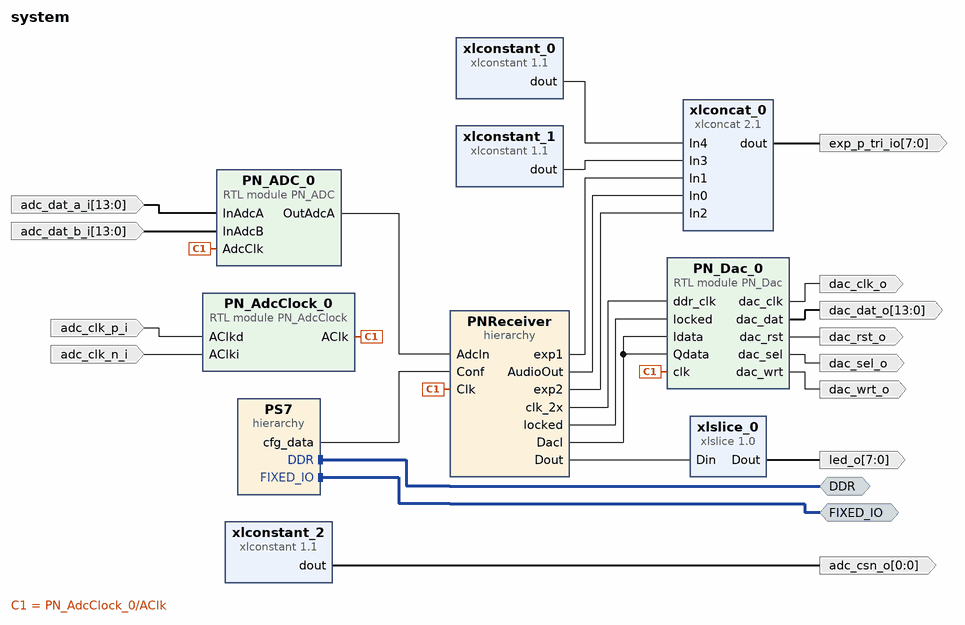
[diagram p0: block diagram of the top level]
# Vivado block design system, xc7z010clg400-2, Vivado 2017.2
create_bd_design system

create_bd_intf_port -mode Master -vlnv xilinx.com:interface:ddrx_rtl:1.0 DDR
create_bd_intf_port -mode Master -vlnv xilinx.com:display_processing_system7:fixedio_rtl:1.0 FIXED_IO
create_bd_port -dir O -from 7 -to 0 led_o
create_bd_port -dir O -from 7 -to 0 -type data exp_p_tri_io
create_bd_port -dir O -from 0 -to 0 adc_csn_o
create_bd_port -dir I adc_clk_p_i
create_bd_port -dir I adc_clk_n_i
create_bd_port -dir I -from 13 -to 0 adc_dat_a_i
create_bd_port -dir I -from 13 -to 0 adc_dat_b_i
create_bd_port -dir O dac_clk_o
create_bd_port -dir O dac_rst_o
create_bd_port -dir O dac_sel_o
create_bd_port -dir O dac_wrt_o
create_bd_port -dir O -from 13 -to 0 dac_dat_o

create_bd_cell -type hier PS7
create_bd_cell -type ip -vlnv xilinx.com:ip:xlslice:1.0 xlslice_0
set_property -dict {CONFIG.DIN_TO 0 CONFIG.DIN_FROM 7 CONFIG.DIN_WIDTH 16 CONFIG.DOUT_WIDTH 8} [get_bd_cells xlslice_0]
create_bd_cell -type ip -vlnv xilinx.com:ip:xlconcat:2.1 xlconcat_0
set_property -dict [list \
  CONFIG.NUM_PORTS 5 \
  CONFIG.IN0_WIDTH 1 \
  CONFIG.IN1_WIDTH 1 \
  CONFIG.IN2_WIDTH 1 \
  CONFIG.IN3_WIDTH 1 \
  CONFIG.IN4_WIDTH 4 \
] [get_bd_cells xlconcat_0]
create_bd_cell -type ip -vlnv xilinx.com:ip:xlconstant:1.1 xlconstant_0
set_property -dict {CONFIG.CONST_WIDTH 4 CONFIG.CONST_VAL 0} [get_bd_cells xlconstant_0]
create_bd_cell -type ip -vlnv xilinx.com:ip:xlconstant:1.1 xlconstant_1
set_property -dict {CONFIG.CONST_VAL 0} [get_bd_cells xlconstant_1]
create_bd_cell -type ip -vlnv xilinx.com:ip:xlconstant:1.1 xlconstant_2
create_bd_cell -type hier PNReceiver
create_bd_cell -type module -reference PN_AdcClock PN_AdcClock_0
create_bd_cell -type module -reference PN_ADC PN_ADC_0
create_bd_cell -type module -reference PN_Dac PN_Dac_0

# ---- hierarchy /PS7 ----
current_bd_instance /PS7
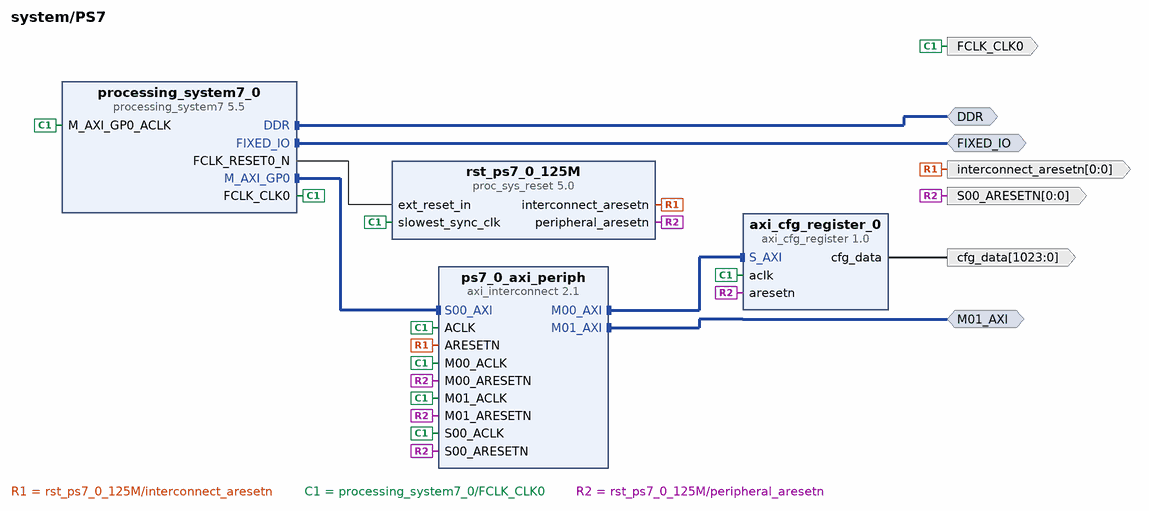
[diagram p1: block diagram inside /PS7]
create_bd_intf_pin -mode Master -vlnv xilinx.com:interface:ddrx_rtl:1.0 DDR
create_bd_intf_pin -mode Master -vlnv xilinx.com:display_processing_system7:fixedio_rtl:1.0 FIXED_IO
create_bd_intf_pin -mode Master -vlnv xilinx.com:interface:aximm_rtl:1.0 M01_AXI
create_bd_pin -dir O -type clk FCLK_CLK0
create_bd_pin -dir O -from 0 -to 0 -type rst S00_ARESETN
create_bd_pin -dir O -from 0 -to 0 -type rst interconnect_aresetn
create_bd_pin -dir O -from 1023 -to 0 cfg_data

create_bd_cell -type ip -vlnv xilinx.com:ip:processing_system7:5.5 processing_system7_0
set_property -dict [list \
  CONFIG.PCW_CPU_CPU_6X4X_MAX_RANGE 767 \
  CONFIG.PCW_QSPI_PERIPHERAL_FREQMHZ 125 \
  CONFIG.PCW_I2C_PERIPHERAL_FREQMHZ 111.111115 \
  CONFIG.PCW_FPGA0_PERIPHERAL_FREQMHZ 125 \
  CONFIG.PCW_FPGA1_PERIPHERAL_FREQMHZ 250 \
  CONFIG.PCW_FPGA3_PERIPHERAL_FREQMHZ 200 \
  CONFIG.PCW_IMPORT_BOARD_PRESET cfg/red_pitaya.xml \
  CONFIG.PCW_PRESET_BANK1_VOLTAGE {LVCMOS 2.5V} \
  CONFIG.PCW_UIPARAM_DDR_BUS_WIDTH {16 Bit} \
  CONFIG.PCW_UIPARAM_DDR_PARTNO {MT41J256M16 RE-125} \
  CONFIG.PCW_QSPI_PERIPHERAL_ENABLE 1 \
  CONFIG.PCW_QSPI_QSPI_IO {MIO 1 .. 6} \
  CONFIG.PCW_QSPI_GRP_SINGLE_SS_ENABLE 1 \
  CONFIG.PCW_QSPI_GRP_SINGLE_SS_IO {MIO 1 .. 6} \
  CONFIG.PCW_ENET0_PERIPHERAL_ENABLE 1 \
  CONFIG.PCW_ENET0_ENET0_IO {MIO 16 .. 27} \
  CONFIG.PCW_ENET0_GRP_MDIO_ENABLE 1 \
  CONFIG.PCW_ENET0_GRP_MDIO_IO EMIO \
  CONFIG.PCW_ENET_RESET_ENABLE 1 \
  CONFIG.PCW_ENET_RESET_SELECT {Share reset pin} \
  CONFIG.PCW_SD0_PERIPHERAL_ENABLE 1 \
  CONFIG.PCW_SD0_SD0_IO {MIO 40 .. 45} \
  CONFIG.PCW_SD0_GRP_CD_ENABLE 1 \
  CONFIG.PCW_SD0_GRP_CD_IO {MIO 46} \
  CONFIG.PCW_SD0_GRP_WP_ENABLE 1 \
  CONFIG.PCW_SD0_GRP_WP_IO {MIO 47} \
  CONFIG.PCW_UART0_PERIPHERAL_ENABLE 1 \
  CONFIG.PCW_UART0_UART0_IO {MIO 14 .. 15} \
  CONFIG.PCW_UART1_PERIPHERAL_ENABLE 1 \
  CONFIG.PCW_UART1_UART1_IO {MIO 8 .. 9} \
  CONFIG.PCW_SPI0_PERIPHERAL_ENABLE 1 \
  CONFIG.PCW_SPI0_SPI0_IO EMIO \
  CONFIG.PCW_SPI1_PERIPHERAL_ENABLE 1 \
  CONFIG.PCW_SPI1_SPI1_IO {MIO 10 .. 15} \
  CONFIG.PCW_TTC0_PERIPHERAL_ENABLE 1 \
  CONFIG.PCW_TTC0_TTC0_IO EMIO \
  CONFIG.PCW_USB0_PERIPHERAL_ENABLE 1 \
  CONFIG.PCW_USB0_USB0_IO {MIO 28 .. 39} \
  CONFIG.PCW_USB_RESET_ENABLE 1 \
  CONFIG.PCW_USB_RESET_SELECT {Share reset pin} \
  CONFIG.PCW_USB0_RESET_ENABLE 1 \
  CONFIG.PCW_USB0_RESET_IO {MIO 48} \
  CONFIG.PCW_I2C0_PERIPHERAL_ENABLE 1 \
  CONFIG.PCW_I2C0_I2C0_IO {MIO 50 .. 51} \
  CONFIG.PCW_I2C_RESET_ENABLE 1 \
  CONFIG.PCW_I2C_RESET_SELECT {Share reset pin} \
  CONFIG.PCW_GPIO_PERIPHERAL_ENABLE 1 \
  CONFIG.PCW_GPIO_MIO_GPIO_ENABLE 1 \
  CONFIG.PCW_GPIO_MIO_GPIO_IO MIO \
] [get_bd_cells processing_system7_0]
# 183 more settings of processing_system7_0 are not shown: defaults, MIO pin electricals, DDR timing, and values the tool derives
create_bd_cell -type ip -vlnv xilinx.com:ip:axi_interconnect:2.1 ps7_0_axi_periph
set_property -dict {CONFIG.NUM_SI 1 CONFIG.NUM_MI 2} [get_bd_cells ps7_0_axi_periph]
create_bd_cell -type ip -vlnv xilinx.com:ip:proc_sys_reset:5.0 rst_ps7_0_125M
create_bd_cell -type ip -vlnv pavel-demin:user:axi_cfg_register:1.0 axi_cfg_register_0

# ---- hierarchy /PNReceiver ----
current_bd_instance /PNReceiver
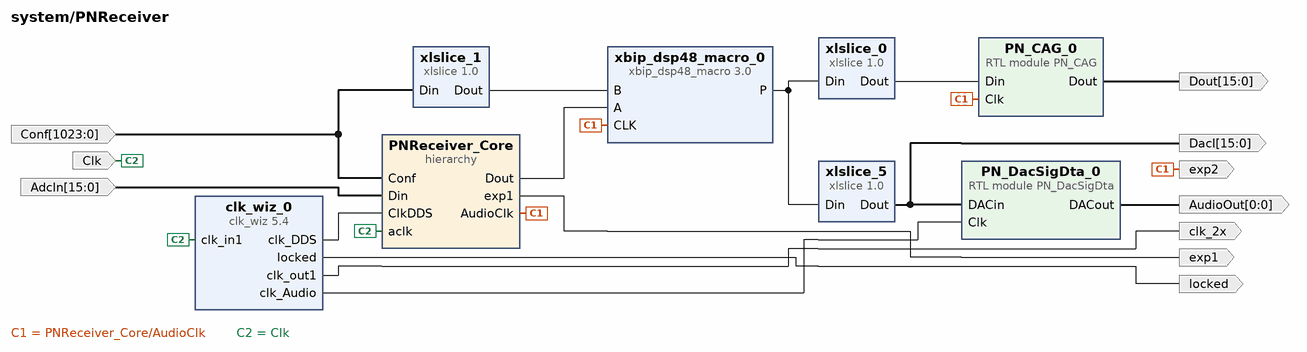
[diagram p2: block diagram inside /PNReceiver]
create_bd_pin -dir O -type clk clk_2x
create_bd_pin -dir O locked
create_bd_pin -dir I -from 1023 -to 0 Conf
create_bd_pin -dir I -type clk Clk
create_bd_pin -dir O -from 0 -to 0 AudioOut
create_bd_pin -dir O -from 15 -to 0 DacI
create_bd_pin -dir O exp2
create_bd_pin -dir O exp1
create_bd_pin -dir O -from 15 -to 0 Dout
create_bd_pin -dir I -from 15 -to 0 -type data AdcIn

create_bd_cell -type ip -vlnv xilinx.com:ip:clk_wiz:5.4 clk_wiz_0
set_property -dict [list \
  CONFIG.ENABLE_CLOCK_MONITOR false \
  CONFIG.PRIMITIVE MMCM \
  CONFIG.USE_PHASE_ALIGNMENT false \
  CONFIG.JITTER_SEL Min_O_Jitter \
  CONFIG.PRIM_IN_FREQ 125.000 \
  CONFIG.SECONDARY_SOURCE Single_ended_clock_capable_pin \
  CONFIG.CLKIN1_JITTER_PS 80.0 \
  CONFIG.CLKOUT2_USED true \
  CONFIG.CLKOUT3_USED true \
  CONFIG.CLKOUT4_USED false \
  CONFIG.NUM_OUT_CLKS 3 \
  CONFIG.CLK_OUT2_PORT clk_DDS \
  CONFIG.CLK_OUT3_PORT clk_Audio \
  CONFIG.CLK_OUT4_PORT clk_out4 \
  CONFIG.CLKOUT1_REQUESTED_OUT_FREQ 250.000 \
  CONFIG.CLKOUT2_REQUESTED_OUT_FREQ 500 \
  CONFIG.CLKOUT3_REQUESTED_OUT_FREQ 7.9 \
  CONFIG.CLKOUT4_REQUESTED_OUT_FREQ 100.000 \
  CONFIG.PRIM_SOURCE Single_ended_clock_capable_pin \
  CONFIG.CLKOUT1_DRIVES BUFG \
  CONFIG.CLKOUT2_DRIVES BUFG \
  CONFIG.CLKOUT3_DRIVES BUFG \
  CONFIG.CLKOUT4_DRIVES BUFG \
  CONFIG.CLKOUT5_DRIVES BUFG \
  CONFIG.CLKOUT6_DRIVES BUFG \
  CONFIG.CLKOUT7_DRIVES BUFG \
  CONFIG.USE_RESET false \
  CONFIG.MMCM_DIVCLK_DIVIDE 1 \
  CONFIG.MMCM_BANDWIDTH HIGH \
  CONFIG.MMCM_CLKFBOUT_MULT_F 8.000 \
  CONFIG.MMCM_CLKIN1_PERIOD 8.000 \
  CONFIG.MMCM_CLKIN2_PERIOD 10.000 \
  CONFIG.MMCM_CLKOUT0_DIVIDE_F 4.000 \
  CONFIG.MMCM_CLKOUT1_DIVIDE 2 \
  CONFIG.MMCM_CLKOUT2_DIVIDE 127 \
  CONFIG.MMCM_CLKOUT3_DIVIDE 1 \
  CONFIG.CLKOUT1_JITTER 104.759 \
  CONFIG.CLKOUT1_PHASE_ERROR 96.948 \
  CONFIG.CLKOUT2_JITTER 92.027 \
  CONFIG.CLKOUT2_PHASE_ERROR 96.948 \
  CONFIG.CLKOUT3_JITTER 207.034 \
  CONFIG.CLKOUT3_PHASE_ERROR 96.948 \
  CONFIG.CLKOUT4_JITTER 132.845 \
  CONFIG.CLKOUT4_PHASE_ERROR 306.660 \
] [get_bd_cells clk_wiz_0]
create_bd_cell -type ip -vlnv xilinx.com:ip:xlslice:1.0 xlslice_5
set_property -dict {CONFIG.DIN_TO 0 CONFIG.DIN_FROM 15 CONFIG.DIN_WIDTH 40 CONFIG.DOUT_WIDTH 16} [get_bd_cells xlslice_5]
create_bd_cell -type hier PNReceiver_Core
create_bd_cell -type ip -vlnv xilinx.com:ip:xlslice:1.0 xlslice_1
set_property -dict {CONFIG.DIN_TO 32 CONFIG.DIN_FROM 47 CONFIG.DIN_WIDTH 1024 CONFIG.DOUT_WIDTH 16} [get_bd_cells xlslice_1]
create_bd_cell -type ip -vlnv xilinx.com:ip:xbip_dsp48_macro:3.0 xbip_dsp48_macro_0
set_property -dict [list \
  CONFIG.instruction1 {A*B} \
  CONFIG.areg_3 true \
  CONFIG.areg_4 true \
  CONFIG.breg_3 true \
  CONFIG.breg_4 true \
  CONFIG.creg_3 false \
  CONFIG.creg_4 false \
  CONFIG.creg_5 false \
  CONFIG.mreg_5 true \
  CONFIG.preg_6 true \
  CONFIG.a_width 24 \
  CONFIG.a_binarywidth 0 \
  CONFIG.b_width 16 \
  CONFIG.b_binarywidth 0 \
  CONFIG.output_properties Full_Precision \
  CONFIG.p_full_width 40 \
  CONFIG.p_width 40 \
  CONFIG.p_binarywidth 0 \
  CONFIG.use_dsp48 true \
] [get_bd_cells xbip_dsp48_macro_0]
create_bd_cell -type ip -vlnv xilinx.com:ip:xlslice:1.0 xlslice_0
set_property -dict {CONFIG.DIN_TO 0 CONFIG.DIN_FROM 23 CONFIG.DIN_WIDTH 40 CONFIG.DOUT_WIDTH 24} [get_bd_cells xlslice_0]
create_bd_cell -type module -reference PN_CAG PN_CAG_0
create_bd_cell -type module -reference PN_DacSigDta PN_DacSigDta_0

# ---- hierarchy /PNReceiver/PNReceiver_Core ----
current_bd_instance /PNReceiver/PNReceiver_Core
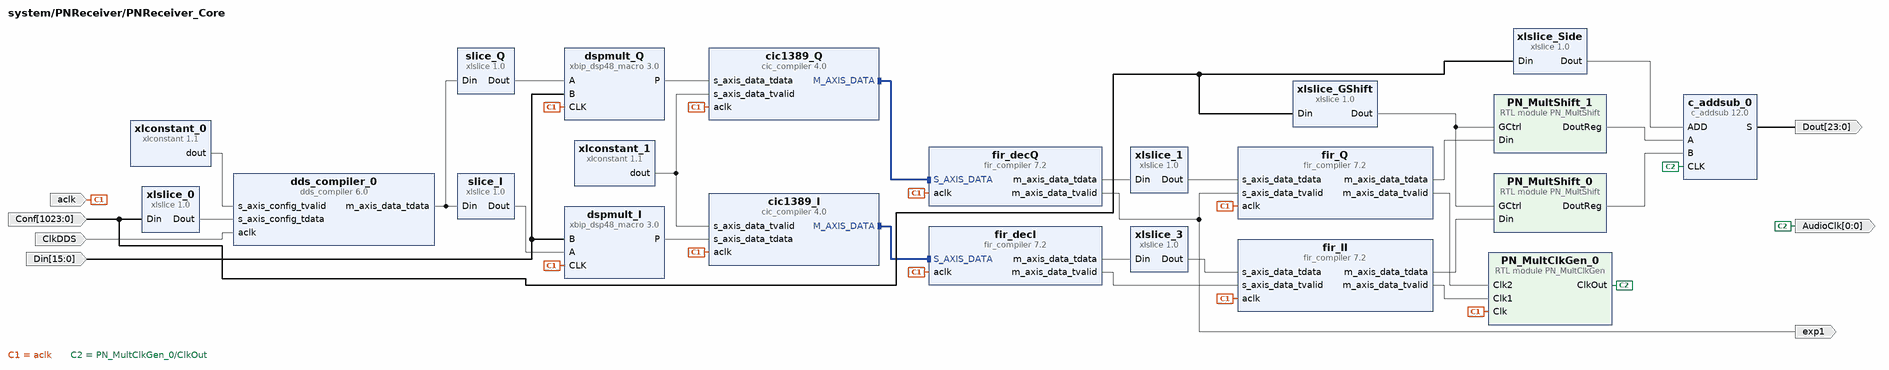
[diagram p3: block diagram inside /PNReceiver/PNReceiver_Core]
create_bd_pin -dir O -from 23 -to 0 -type data Dout
create_bd_pin -dir I -type clk ClkDDS
create_bd_pin -dir I -from 1023 -to 0 Conf
create_bd_pin -dir I -from 15 -to 0 -type data Din
create_bd_pin -dir O exp1
create_bd_pin -dir O -from 0 -to 0 AudioClk
create_bd_pin -dir I -type clk aclk

create_bd_cell -type ip -vlnv xilinx.com:ip:xlconstant:1.1 xlconstant_0
create_bd_cell -type ip -vlnv xilinx.com:ip:xlslice:1.0 slice_I
set_property -dict {CONFIG.DIN_FROM 15 CONFIG.DOUT_WIDTH 16} [get_bd_cells slice_I]
create_bd_cell -type ip -vlnv xilinx.com:ip:cic_compiler:4.0 cic1389_I
set_property -dict [list \
  CONFIG.Filter_Type Decimation \
  CONFIG.Number_Of_Stages 6 \
  CONFIG.Fixed_Or_Initial_Rate 1389 \
  CONFIG.Minimum_Rate 1389 \
  CONFIG.Maximum_Rate 1389 \
  CONFIG.RateSpecification Frequency_Specification \
  CONFIG.Input_Sample_Frequency 125 \
  CONFIG.Clock_Frequency 125 \
  CONFIG.SamplePeriod 1 \
  CONFIG.Response_Magnitude Full_Precision \
  CONFIG.Passband_Max 0.005 \
  CONFIG.Input_Data_Width 32 \
  CONFIG.Quantization Truncation \
  CONFIG.Output_Data_Width 32 \
  CONFIG.Use_Xtreme_DSP_Slice false \
] [get_bd_cells cic1389_I]
create_bd_cell -type ip -vlnv xilinx.com:ip:c_addsub:12.0 c_addsub_0
set_property -dict [list \
  CONFIG.Implementation Fabric \
  CONFIG.A_Type Signed \
  CONFIG.B_Type Signed \
  CONFIG.A_Width 24 \
  CONFIG.B_Width 24 \
  CONFIG.Add_Mode Add_Subtract \
  CONFIG.Out_Width 24 \
  CONFIG.Latency_Configuration Automatic \
  CONFIG.Latency 2 \
  CONFIG.B_Constant false \
  CONFIG.B_Value 000000000000000000000000 \
  CONFIG.CE false \
] [get_bd_cells c_addsub_0]
create_bd_cell -type ip -vlnv xilinx.com:ip:dds_compiler:6.0 dds_compiler_0
set_property -dict [list \
  CONFIG.DDS_Clock_Rate 500 \
  CONFIG.Parameter_Entry Hardware_Parameters \
  CONFIG.Frequency_Resolution 0.4 \
  CONFIG.Noise_Shaping None \
  CONFIG.Phase_Width 32 \
  CONFIG.Output_Width 16 \
  CONFIG.Phase_Increment Programmable \
  CONFIG.Output_Selection Sine_and_Cosine \
  CONFIG.Optimization_Goal Speed \
  CONFIG.Has_Phase_Out false \
  CONFIG.DATA_Has_TLAST Not_Required \
  CONFIG.S_PHASE_Has_TUSER Not_Required \
  CONFIG.M_DATA_Has_TUSER Not_Required \
  CONFIG.Latency 9 \
  CONFIG.Output_Frequency1 0 \
  CONFIG.PINC1 10100111110001011 \
] [get_bd_cells dds_compiler_0]
create_bd_cell -type ip -vlnv xilinx.com:ip:xbip_dsp48_macro:3.0 dspmult_I
set_property -dict [list \
  CONFIG.instruction1 {A*B} \
  CONFIG.pipeline_options Automatic \
  CONFIG.areg_3 true \
  CONFIG.areg_4 true \
  CONFIG.breg_3 true \
  CONFIG.breg_4 true \
  CONFIG.creg_1 false \
  CONFIG.creg_3 false \
  CONFIG.creg_4 false \
  CONFIG.creg_5 false \
  CONFIG.cinreg_3 false \
  CONFIG.cinreg_4 false \
  CONFIG.cinreg_5 false \
  CONFIG.mreg_5 true \
  CONFIG.preg_6 true \
  CONFIG.d_width 18 \
  CONFIG.a_width 16 \
  CONFIG.a_binarywidth 0 \
  CONFIG.b_width 16 \
  CONFIG.b_binarywidth 0 \
  CONFIG.concat_width 48 \
  CONFIG.concat_binarywidth 0 \
  CONFIG.c_width 48 \
  CONFIG.c_binarywidth 0 \
  CONFIG.pcin_binarywidth 0 \
  CONFIG.output_properties Full_Precision \
  CONFIG.p_full_width 32 \
  CONFIG.p_width 32 \
  CONFIG.p_binarywidth 0 \
  CONFIG.use_dsp48 true \
] [get_bd_cells dspmult_I]
create_bd_cell -type ip -vlnv xilinx.com:ip:fir_compiler:7.2 fir_decQ
set_property -dict [list \
  CONFIG.CoefficientSource COE_File \
  CONFIG.Coefficient_File ../../../../../../Filtre/Coeffd.coe \
  CONFIG.Coefficient_Sets 1 \
  CONFIG.Filter_Type Decimation \
  CONFIG.Interpolation_Rate 1 \
  CONFIG.Decimation_Rate 11 \
  CONFIG.Zero_Pack_Factor 1 \
  CONFIG.Number_Channels 1 \
  CONFIG.RateSpecification Frequency_Specification \
  CONFIG.Sample_Frequency 0.09 \
  CONFIG.Clock_Frequency 125 \
  CONFIG.Coefficient_Sign Signed \
  CONFIG.Quantization Quantize_Only \
  CONFIG.Coefficient_Width 24 \
  CONFIG.BestPrecision true \
  CONFIG.Coefficient_Fractional_Bits 18 \
  CONFIG.Coefficient_Structure Symmetric \
  CONFIG.Data_Width 32 \
  CONFIG.Output_Rounding_Mode Truncate_LSBs \
  CONFIG.Output_Width 37 \
  CONFIG.Filter_Architecture Systolic_Multiply_Accumulate \
  CONFIG.Optimization_Goal Area \
  CONFIG.Optimization_Selection None \
  CONFIG.Optimization_List None \
  CONFIG.S_DATA_Has_FIFO false \
] [get_bd_cells fir_decQ]
create_bd_cell -type ip -vlnv xilinx.com:ip:xlslice:1.0 slice_Q
set_property -dict {CONFIG.DIN_TO 16 CONFIG.DIN_FROM 31 CONFIG.DOUT_WIDTH 16} [get_bd_cells slice_Q]
create_bd_cell -type ip -vlnv xilinx.com:ip:cic_compiler:4.0 cic1389_Q
set_property -dict [list \
  CONFIG.Filter_Type Decimation \
  CONFIG.Number_Of_Stages 6 \
  CONFIG.Fixed_Or_Initial_Rate 1389 \
  CONFIG.Minimum_Rate 1389 \
  CONFIG.Maximum_Rate 1389 \
  CONFIG.RateSpecification Frequency_Specification \
  CONFIG.Input_Sample_Frequency 125 \
  CONFIG.Clock_Frequency 125 \
  CONFIG.SamplePeriod 1 \
  CONFIG.Response_Magnitude Full_Precision \
  CONFIG.Passband_Max 0.005 \
  CONFIG.Input_Data_Width 32 \
  CONFIG.Quantization Truncation \
  CONFIG.Output_Data_Width 32 \
  CONFIG.Use_Xtreme_DSP_Slice false \
] [get_bd_cells cic1389_Q]
create_bd_cell -type ip -vlnv xilinx.com:ip:fir_compiler:7.2 fir_decI
set_property -dict [list \
  CONFIG.CoefficientSource COE_File \
  CONFIG.Coefficient_File ../../../../../../Filtre/Coeffd.coe \
  CONFIG.Coefficient_Sets 1 \
  CONFIG.Filter_Type Decimation \
  CONFIG.Interpolation_Rate 1 \
  CONFIG.Decimation_Rate 11 \
  CONFIG.Zero_Pack_Factor 1 \
  CONFIG.Number_Channels 1 \
  CONFIG.RateSpecification Frequency_Specification \
  CONFIG.Sample_Frequency 0.09 \
  CONFIG.Clock_Frequency 125 \
  CONFIG.Coefficient_Sign Signed \
  CONFIG.Quantization Quantize_Only \
  CONFIG.Coefficient_Width 24 \
  CONFIG.BestPrecision true \
  CONFIG.Coefficient_Fractional_Bits 18 \
  CONFIG.Coefficient_Structure Symmetric \
  CONFIG.Data_Width 32 \
  CONFIG.Output_Rounding_Mode Truncate_LSBs \
  CONFIG.Output_Width 37 \
  CONFIG.Filter_Architecture Systolic_Multiply_Accumulate \
  CONFIG.Optimization_Goal Area \
  CONFIG.Optimization_Selection None \
  CONFIG.Optimization_List None \
  CONFIG.S_DATA_Has_FIFO false \
] [get_bd_cells fir_decI]
create_bd_cell -type ip -vlnv xilinx.com:ip:xbip_dsp48_macro:3.0 dspmult_Q
set_property -dict [list \
  CONFIG.show_filtered false \
  CONFIG.instruction1 {A*B} \
  CONFIG.instruction2 {#} \
  CONFIG.instruction3 {#} \
  CONFIG.instruction4 {#} \
  CONFIG.instruction5 {#} \
  CONFIG.instruction6 {#} \
  CONFIG.instruction7 {#} \
  CONFIG.instruction8 {#} \
  CONFIG.pipeline_options Automatic \
  CONFIG.areg_3 true \
  CONFIG.areg_4 true \
  CONFIG.breg_3 true \
  CONFIG.breg_4 true \
  CONFIG.creg_1 false \
  CONFIG.creg_3 false \
  CONFIG.creg_4 false \
  CONFIG.creg_5 false \
  CONFIG.cinreg_3 false \
  CONFIG.cinreg_4 false \
  CONFIG.cinreg_5 false \
  CONFIG.mreg_5 true \
  CONFIG.preg_6 true \
  CONFIG.d_width 18 \
  CONFIG.a_width 16 \
  CONFIG.a_binarywidth 0 \
  CONFIG.b_width 16 \
  CONFIG.b_binarywidth 0 \
  CONFIG.concat_width 48 \
  CONFIG.concat_binarywidth 0 \
  CONFIG.c_width 48 \
  CONFIG.c_binarywidth 0 \
  CONFIG.pcin_binarywidth 0 \
  CONFIG.output_properties Full_Precision \
  CONFIG.p_full_width 32 \
  CONFIG.p_width 32 \
  CONFIG.p_binarywidth 0 \
  CONFIG.use_dsp48 true \
] [get_bd_cells dspmult_Q]
create_bd_cell -type ip -vlnv xilinx.com:ip:xlslice:1.0 xlslice_0
set_property -dict {CONFIG.DIN_TO 0 CONFIG.DIN_FROM 31 CONFIG.DIN_WIDTH 1024 CONFIG.DOUT_WIDTH 32} [get_bd_cells xlslice_0]
create_bd_cell -type ip -vlnv xilinx.com:ip:xlslice:1.0 xlslice_Side
set_property -dict {CONFIG.DIN_TO 64 CONFIG.DIN_FROM 64 CONFIG.DIN_WIDTH 1024 CONFIG.DOUT_WIDTH 1} [get_bd_cells xlslice_Side]
create_bd_cell -type ip -vlnv xilinx.com:ip:xlconstant:1.1 xlconstant_1
create_bd_cell -type ip -vlnv xilinx.com:ip:fir_compiler:7.2 fir_Q
set_property -dict [list \
  CONFIG.CoefficientSource COE_File \
  CONFIG.CoefficientVector 6,0,-4,-3,5,6,-6,-13,7,44,64,44,7,-13,-6,6,5,-3,-4,0,6 \
  CONFIG.Coefficient_File ../../../../../../Filtre/Coeffh.coe \
  CONFIG.Coefficient_Sets 1 \
  CONFIG.Filter_Type Single_Rate \
  CONFIG.Interpolation_Rate 1 \
  CONFIG.Decimation_Rate 1 \
  CONFIG.Zero_Pack_Factor 1 \
  CONFIG.Number_Channels 1 \
  CONFIG.Select_Pattern All \
  CONFIG.RateSpecification Frequency_Specification \
  CONFIG.Sample_Frequency 0.0083333 \
  CONFIG.Clock_Frequency 125 \
  CONFIG.Coefficient_Sign Signed \
  CONFIG.Quantization Integer_Coefficients \
  CONFIG.Coefficient_Width 24 \
  CONFIG.Coefficient_Fractional_Bits 0 \
  CONFIG.Coefficient_Structure Inferred \
  CONFIG.Data_Sign Signed \
  CONFIG.Data_Width 32 \
  CONFIG.Data_Fractional_Bits 0 \
  CONFIG.Output_Rounding_Mode Truncate_LSBs \
  CONFIG.Output_Width 39 \
  CONFIG.Filter_Architecture Systolic_Multiply_Accumulate \
  CONFIG.Optimization_Goal Area \
  CONFIG.Optimization_Selection None \
  CONFIG.Optimization_List None \
  CONFIG.Multi_Column_Support Automatic \
  CONFIG.ColumnConfig 1 \
  CONFIG.DATA_Has_TLAST Not_Required \
  CONFIG.S_DATA_Has_FIFO false \
  CONFIG.S_DATA_Has_TUSER Not_Required \
  CONFIG.M_DATA_Has_TUSER Not_Required \
] [get_bd_cells fir_Q]
create_bd_cell -type module -reference PN_MultClkGen PN_MultClkGen_0
create_bd_cell -type ip -vlnv xilinx.com:ip:xlslice:1.0 xlslice_1
set_property -dict {CONFIG.DIN_TO 0 CONFIG.DIN_FROM 31 CONFIG.DIN_WIDTH 40 CONFIG.DOUT_WIDTH 32} [get_bd_cells xlslice_1]
create_bd_cell -type ip -vlnv xilinx.com:ip:xlslice:1.0 xlslice_3
set_property -dict {CONFIG.DIN_TO 0 CONFIG.DIN_FROM 31 CONFIG.DIN_WIDTH 40 CONFIG.DOUT_WIDTH 32} [get_bd_cells xlslice_3]
create_bd_cell -type ip -vlnv xilinx.com:ip:fir_compiler:7.2 fir_II
set_property -dict [list \
  CONFIG.CoefficientSource COE_File \
  CONFIG.CoefficientVector 6,0,-4,-3,5,6,-6,-13,7,44,64,44,7,-13,-6,6,5,-3,-4,0,6 \
  CONFIG.Coefficient_File ../../../../../../Filtre/Coeff.coe \
  CONFIG.Coefficient_Sets 1 \
  CONFIG.Filter_Type Single_Rate \
  CONFIG.Interpolation_Rate 1 \
  CONFIG.Decimation_Rate 1 \
  CONFIG.Zero_Pack_Factor 1 \
  CONFIG.Number_Channels 1 \
  CONFIG.Select_Pattern All \
  CONFIG.RateSpecification Frequency_Specification \
  CONFIG.Sample_Frequency 0.0083333 \
  CONFIG.Clock_Frequency 125 \
  CONFIG.Coefficient_Sign Signed \
  CONFIG.Quantization Integer_Coefficients \
  CONFIG.Coefficient_Width 24 \
  CONFIG.Coefficient_Fractional_Bits 0 \
  CONFIG.Coefficient_Structure Inferred \
  CONFIG.Data_Sign Signed \
  CONFIG.Data_Width 32 \
  CONFIG.Data_Fractional_Bits 0 \
  CONFIG.Output_Rounding_Mode Truncate_LSBs \
  CONFIG.Output_Width 39 \
  CONFIG.Filter_Architecture Systolic_Multiply_Accumulate \
  CONFIG.Optimization_Goal Area \
  CONFIG.Optimization_Selection None \
  CONFIG.Optimization_List None \
  CONFIG.Multi_Column_Support Automatic \
  CONFIG.ColumnConfig 1 \
  CONFIG.DATA_Has_TLAST Not_Required \
  CONFIG.S_DATA_Has_FIFO false \
  CONFIG.S_DATA_Has_TUSER Not_Required \
  CONFIG.M_DATA_Has_TUSER Not_Required \
] [get_bd_cells fir_II]
create_bd_cell -type ip -vlnv xilinx.com:ip:xlslice:1.0 xlslice_GShift
set_property -dict {CONFIG.DIN_TO 48 CONFIG.DIN_FROM 51 CONFIG.DIN_WIDTH 1024 CONFIG.DOUT_WIDTH 4} [get_bd_cells xlslice_GShift]
create_bd_cell -type module -reference PN_MultShift PN_MultShift_0
create_bd_cell -type module -reference PN_MultShift PN_MultShift_1

# ---- connections ----

current_bd_instance /PS7
connect_bd_intf_net [get_bd_intf_pins processing_system7_0/M_AXI_GP0] [get_bd_intf_pins ps7_0_axi_periph/S00_AXI]
connect_bd_intf_net [get_bd_intf_pins ps7_0_axi_periph/M00_AXI] [get_bd_intf_pins axi_cfg_register_0/S_AXI]
connect_bd_intf_net [get_bd_intf_pins DDR] [get_bd_intf_pins processing_system7_0/DDR]
connect_bd_intf_net [get_bd_intf_pins FIXED_IO] [get_bd_intf_pins processing_system7_0/FIXED_IO]
connect_bd_intf_net [get_bd_intf_pins M01_AXI] [get_bd_intf_pins ps7_0_axi_periph/M01_AXI]
connect_bd_net [get_bd_pins processing_system7_0/FCLK_RESET0_N] [get_bd_pins rst_ps7_0_125M/ext_reset_in]
connect_bd_net [get_bd_pins rst_ps7_0_125M/interconnect_aresetn] [get_bd_pins interconnect_aresetn] [get_bd_pins ps7_0_axi_periph/ARESETN]
connect_bd_net [get_bd_pins processing_system7_0/FCLK_CLK0] \
  [get_bd_pins FCLK_CLK0] [get_bd_pins processing_system7_0/M_AXI_GP0_ACLK] [get_bd_pins rst_ps7_0_125M/slowest_sync_clk] \
  [get_bd_pins axi_cfg_register_0/aclk] [get_bd_pins ps7_0_axi_periph/ACLK] [get_bd_pins ps7_0_axi_periph/S00_ACLK] \
  [get_bd_pins ps7_0_axi_periph/M00_ACLK] [get_bd_pins ps7_0_axi_periph/M01_ACLK]
connect_bd_net [get_bd_pins rst_ps7_0_125M/peripheral_aresetn] \
  [get_bd_pins S00_ARESETN] [get_bd_pins axi_cfg_register_0/aresetn] [get_bd_pins ps7_0_axi_periph/S00_ARESETN] \
  [get_bd_pins ps7_0_axi_periph/M00_ARESETN] [get_bd_pins ps7_0_axi_periph/M01_ARESETN]
connect_bd_net [get_bd_pins axi_cfg_register_0/cfg_data] [get_bd_pins cfg_data]

current_bd_instance /PNReceiver
connect_bd_net [get_bd_pins clk_wiz_0/locked] [get_bd_pins locked]
connect_bd_net [get_bd_pins clk_wiz_0/clk_out1] [get_bd_pins clk_2x]
connect_bd_net [get_bd_pins xlslice_5/Dout] [get_bd_pins DacI] [get_bd_pins PN_DacSigDta_0/DACin]
connect_bd_net -net Din_1 [get_bd_pins Conf] [get_bd_pins xlslice_1/Din] [get_bd_pins PNReceiver_Core/Conf]
connect_bd_net [get_bd_pins clk_wiz_0/clk_DDS] [get_bd_pins PNReceiver_Core/ClkDDS]
connect_bd_net -net PNReceiver_Core_m_axis_data_tvalid1 [get_bd_pins PNReceiver_Core/exp1] [get_bd_pins exp1]
connect_bd_net [get_bd_pins PN_CAG_0/Dout] [get_bd_pins Dout]
connect_bd_net -net mult_gen_0_P [get_bd_pins xbip_dsp48_macro_0/P] [get_bd_pins xlslice_5/Din] [get_bd_pins xlslice_0/Din]
connect_bd_net -net PNReceiver_Core_exp2 [get_bd_pins PNReceiver_Core/AudioClk] \
  [get_bd_pins exp2] [get_bd_pins xbip_dsp48_macro_0/CLK] [get_bd_pins PN_CAG_0/Clk]
connect_bd_net [get_bd_pins xlslice_1/Dout] [get_bd_pins xbip_dsp48_macro_0/B]
connect_bd_net -net util_ds_buf_0_BUFG_O [get_bd_pins Clk] [get_bd_pins clk_wiz_0/clk_in1] [get_bd_pins PNReceiver_Core/aclk]
connect_bd_net [get_bd_pins AdcIn] [get_bd_pins PNReceiver_Core/Din]
connect_bd_net [get_bd_pins xlslice_0/Dout] [get_bd_pins PN_CAG_0/Din]
connect_bd_net [get_bd_pins PNReceiver_Core/Dout] [get_bd_pins xbip_dsp48_macro_0/A]
connect_bd_net [get_bd_pins clk_wiz_0/clk_Audio] [get_bd_pins PN_DacSigDta_0/Clk]
connect_bd_net [get_bd_pins PN_DacSigDta_0/DACout] [get_bd_pins AudioOut]

current_bd_instance /PNReceiver/PNReceiver_Core
connect_bd_intf_net [get_bd_intf_pins cic1389_Q/M_AXIS_DATA] [get_bd_intf_pins fir_decQ/S_AXIS_DATA]
connect_bd_intf_net [get_bd_intf_pins cic1389_I/M_AXIS_DATA] [get_bd_intf_pins fir_decI/S_AXIS_DATA]
connect_bd_net [get_bd_pins xlconstant_0/dout] [get_bd_pins dds_compiler_0/s_axis_config_tvalid]
connect_bd_net [get_bd_pins dds_compiler_0/m_axis_data_tdata] [get_bd_pins slice_I/Din] [get_bd_pins slice_Q/Din]
connect_bd_net -net xlslice_1_Dout [get_bd_pins slice_I/Dout] [get_bd_pins dspmult_I/A]
connect_bd_net [get_bd_pins Din] [get_bd_pins dspmult_I/B] [get_bd_pins dspmult_Q/B]
connect_bd_net -net xlslice_2_Dout [get_bd_pins slice_Q/Dout] [get_bd_pins dspmult_Q/A]
connect_bd_net [get_bd_pins c_addsub_0/S] [get_bd_pins Dout]
connect_bd_net -net aclk_1 [get_bd_pins ClkDDS] [get_bd_pins dds_compiler_0/aclk]
connect_bd_net -net Din1_1 [get_bd_pins Conf] [get_bd_pins xlslice_Side/Din] [get_bd_pins xlslice_0/Din] [get_bd_pins xlslice_GShift/Din]
connect_bd_net [get_bd_pins xlslice_0/Dout] [get_bd_pins dds_compiler_0/s_axis_config_tdata]
connect_bd_net [get_bd_pins xlconstant_1/dout] [get_bd_pins cic1389_I/s_axis_data_tvalid] [get_bd_pins cic1389_Q/s_axis_data_tvalid]
connect_bd_net -net util_ds_buf_0_BUFG_O [get_bd_pins aclk] \
  [get_bd_pins fir_decI/aclk] [get_bd_pins fir_decQ/aclk] [get_bd_pins PN_MultClkGen_0/Clk] [get_bd_pins fir_Q/aclk] \
  [get_bd_pins dspmult_I/CLK] [get_bd_pins cic1389_Q/aclk] [get_bd_pins dspmult_Q/CLK] [get_bd_pins cic1389_I/aclk] \
  [get_bd_pins fir_II/aclk]
connect_bd_net -net util_vector_logic_0_Res [get_bd_pins PN_MultClkGen_0/ClkOut] [get_bd_pins AudioClk] [get_bd_pins c_addsub_0/CLK]
connect_bd_net [get_bd_pins fir_Q/m_axis_data_tvalid] [get_bd_pins PN_MultClkGen_0/Clk2]
connect_bd_net -net fir_decQ_m_axis_data_tdata [get_bd_pins xlslice_1/Dout] [get_bd_pins fir_Q/s_axis_data_tdata]
connect_bd_net [get_bd_pins fir_decQ/m_axis_data_tvalid] [get_bd_pins exp1] [get_bd_pins fir_Q/s_axis_data_tvalid]
connect_bd_net [get_bd_pins fir_Q/m_axis_data_tdata] [get_bd_pins PN_MultShift_1/Din]
connect_bd_net -net xlslice_2_Dout1 [get_bd_pins xlslice_Side/Dout] [get_bd_pins c_addsub_0/ADD]
connect_bd_net [get_bd_pins dspmult_Q/P] [get_bd_pins cic1389_Q/s_axis_data_tdata]
connect_bd_net [get_bd_pins dspmult_I/P] [get_bd_pins cic1389_I/s_axis_data_tdata]
connect_bd_net [get_bd_pins fir_decQ/m_axis_data_tdata] [get_bd_pins xlslice_1/Din]
connect_bd_net [get_bd_pins fir_decI/m_axis_data_tdata] [get_bd_pins xlslice_3/Din]
connect_bd_net -net fir_Q1_m_axis_data_tvalid [get_bd_pins fir_II/m_axis_data_tvalid] [get_bd_pins PN_MultClkGen_0/Clk1]
connect_bd_net [get_bd_pins xlslice_3/Dout] [get_bd_pins fir_II/s_axis_data_tdata]
connect_bd_net [get_bd_pins fir_decI/m_axis_data_tvalid] [get_bd_pins fir_II/s_axis_data_tvalid]
connect_bd_net [get_bd_pins PN_MultShift_1/DoutReg] [get_bd_pins c_addsub_0/A]
connect_bd_net [get_bd_pins PN_MultShift_0/DoutReg] [get_bd_pins c_addsub_0/B]
connect_bd_net [get_bd_pins fir_II/m_axis_data_tdata] [get_bd_pins PN_MultShift_0/Din]
connect_bd_net [get_bd_pins xlslice_GShift/Dout] [get_bd_pins PN_MultShift_0/GCtrl] [get_bd_pins PN_MultShift_1/GCtrl]

current_bd_instance /
connect_bd_intf_net -intf_net processing_system7_0_DDR [get_bd_intf_ports DDR] [get_bd_intf_pins PS7/DDR]
connect_bd_intf_net -intf_net processing_system7_0_FIXED_IO [get_bd_intf_ports FIXED_IO] [get_bd_intf_pins PS7/FIXED_IO]
connect_bd_net [get_bd_pins xlslice_0/Dout] [get_bd_ports led_o]
connect_bd_net -net axis_red_pitaya_adc_0_adc_clk [get_bd_pins PN_AdcClock_0/AClk] \
  [get_bd_pins PN_ADC_0/AdcClk] [get_bd_pins PN_Dac_0/clk] [get_bd_pins PNReceiver/Clk]
connect_bd_net [get_bd_pins xlconcat_0/dout] [get_bd_ports exp_p_tri_io]
connect_bd_net [get_bd_pins xlconstant_0/dout] [get_bd_pins xlconcat_0/In4]
connect_bd_net [get_bd_pins xlconstant_1/dout] [get_bd_pins xlconcat_0/In3]
connect_bd_net [get_bd_pins xlconstant_2/dout] [get_bd_ports adc_csn_o]
connect_bd_net [get_bd_ports adc_clk_p_i] [get_bd_pins PN_AdcClock_0/AClkd]
connect_bd_net [get_bd_ports adc_clk_n_i] [get_bd_pins PN_AdcClock_0/AClki]
connect_bd_net [get_bd_ports adc_dat_a_i] [get_bd_pins PN_ADC_0/InAdcA]
connect_bd_net [get_bd_ports adc_dat_b_i] [get_bd_pins PN_ADC_0/InAdcB]
connect_bd_net -net PNReceiver_m_axis_data_tvalid1 [get_bd_pins PNReceiver/exp1] [get_bd_pins xlconcat_0/In1]
connect_bd_net -net PNReceiver_Dout2 [get_bd_pins PNReceiver/AudioOut] [get_bd_pins xlconcat_0/In0]
connect_bd_net [get_bd_pins PN_ADC_0/OutAdcA] [get_bd_pins PNReceiver/AdcIn]
connect_bd_net [get_bd_pins PNReceiver/Dout] [get_bd_pins xlslice_0/Din]
connect_bd_net -net PNReceiver_m_axis_data_tvalid [get_bd_pins PNReceiver/exp2] [get_bd_pins xlconcat_0/In2]
connect_bd_net [get_bd_pins PS7/cfg_data] [get_bd_pins PNReceiver/Conf]
connect_bd_net [get_bd_pins PN_Dac_0/dac_clk] [get_bd_ports dac_clk_o]
connect_bd_net [get_bd_pins PN_Dac_0/dac_rst] [get_bd_ports dac_rst_o]
connect_bd_net [get_bd_pins PN_Dac_0/dac_sel] [get_bd_ports dac_sel_o]
connect_bd_net [get_bd_pins PN_Dac_0/dac_wrt] [get_bd_ports dac_wrt_o]
connect_bd_net [get_bd_pins PN_Dac_0/dac_dat] [get_bd_ports dac_dat_o]
connect_bd_net [get_bd_pins PNReceiver/clk_2x] [get_bd_pins PN_Dac_0/ddr_clk]
connect_bd_net [get_bd_pins PNReceiver/locked] [get_bd_pins PN_Dac_0/locked]
connect_bd_net [get_bd_pins PNReceiver/DacI] [get_bd_pins PN_Dac_0/Idata] [get_bd_pins PN_Dac_0/Qdata]

# ---- address map ----
assign_bd_address -offset 0x40000000 -range 4K -target_address_space [get_bd_addr_spaces PS7/processing_system7_0/Data] [get_bd_addr_segs PS7/axi_cfg_register_0/s_axi/reg0]

validate_bd_design
save_bd_design
